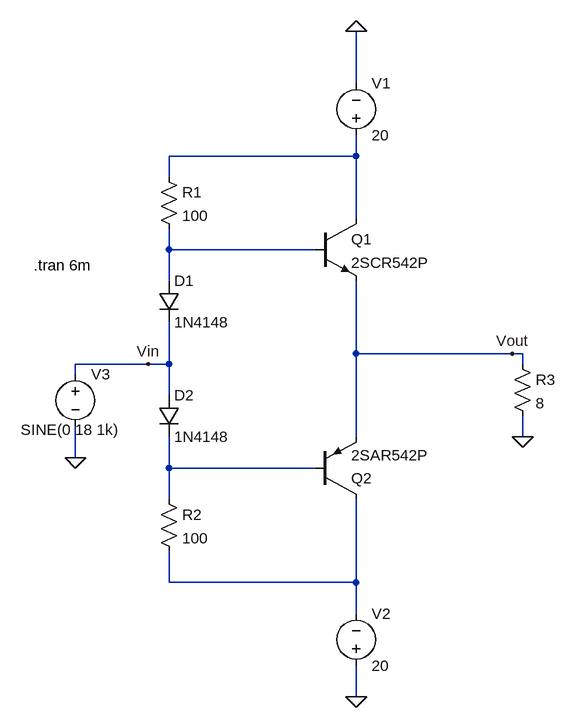
[diagram p0: schematic Class AB pow amp.asc]
Class AB pow amp.asc, the LTspice schematic file:
Version 4
SHEET 1 880 884
WIRE 288 -80 288 -160
WIRE 288 32 288 0
WIRE 288 32 0 32
WIRE 0 64 0 32
WIRE 288 128 288 32
WIRE 0 176 0 144
WIRE 224 176 0 176
WIRE 0 224 0 176
WIRE 288 336 288 224
WIRE 528 336 288 336
WIRE 544 336 528 336
WIRE -32 352 -144 352
WIRE 0 352 0 288
WIRE 0 352 -32 352
WIRE 544 352 544 336
WIRE -144 368 -144 352
WIRE 0 400 0 352
WIRE 288 464 288 336
WIRE 544 464 544 432
WIRE -144 496 -144 448
WIRE 0 512 0 464
WIRE 224 512 0 512
WIRE 0 560 0 512
WIRE 0 688 0 640
WIRE 288 688 288 560
WIRE 288 688 0 688
WIRE 288 736 288 688
WIRE 288 864 288 816
FLAG -144 496 0
FLAG 544 464 0
FLAG 288 864 0
FLAG 288 -160 0
FLAG -32 352 Vin
FLAG 528 336 Vout
SYMBOL npn 224 128 R0
SYMATTR InstName Q1
SYMATTR Value 2SCR542P
SYMBOL pnp 224 560 M180
SYMATTR InstName Q2
SYMATTR Value 2SAR542P
SYMBOL voltage 288 16 M180
WINDOW 0 24 96 Left 2
WINDOW 3 24 16 Left 2
SYMATTR InstName V1
SYMATTR Value 20
SYMBOL diode -16 224 R0
SYMATTR InstName D1
SYMATTR Value 1N4148
SYMBOL diode -16 400 R0
SYMATTR InstName D2
SYMATTR Value 1N4148
SYMBOL res -16 48 R0
SYMATTR InstName R1
SYMATTR Value 100
SYMBOL res -16 544 R0
SYMATTR InstName R2
SYMATTR Value 100
SYMBOL res 528 336 R0
SYMATTR InstName R3
SYMATTR Value 8
SYMBOL voltage -144 352 R0
WINDOW 3 -84 101 Left 2
WINDOW 123 0 0 Left 0
WINDOW 39 0 0 Left 0
SYMATTR InstName V3
SYMATTR Value SINE(0 18 1k)
SYMBOL voltage 288 832 M180
WINDOW 0 24 96 Left 2
WINDOW 3 24 16 Left 2
SYMATTR InstName V2
SYMATTR Value 20
TEXT -208 200 Left 2 !.tran 6m

The netlist it stands for:
* Class AB pow amp.asc
Q1 N001 N002 Vout 0 2SCR542P
Q2 N004 N003 Vout 0 2SAR542P
V1 N001 0 20
D1 N002 Vin 1N4148
D2 Vin N003 1N4148
R1 N001 N002 100
R2 N003 N004 100
R3 Vout 0 8
V3 Vin 0 SINE(0 18 1k)
V2 0 N004 20
.model D D
.lib standard.dio
.model NPN NPN
.model PNP PNP
.lib standard.bjt
.tran 6m
.backanno
.end